# Altium schematic sheet connectors.SchDoc: Oncilla motor control board
size A4; DocumentNumber: 5; Revision: 3; SheetNumber: 5; SheetTotal: 5
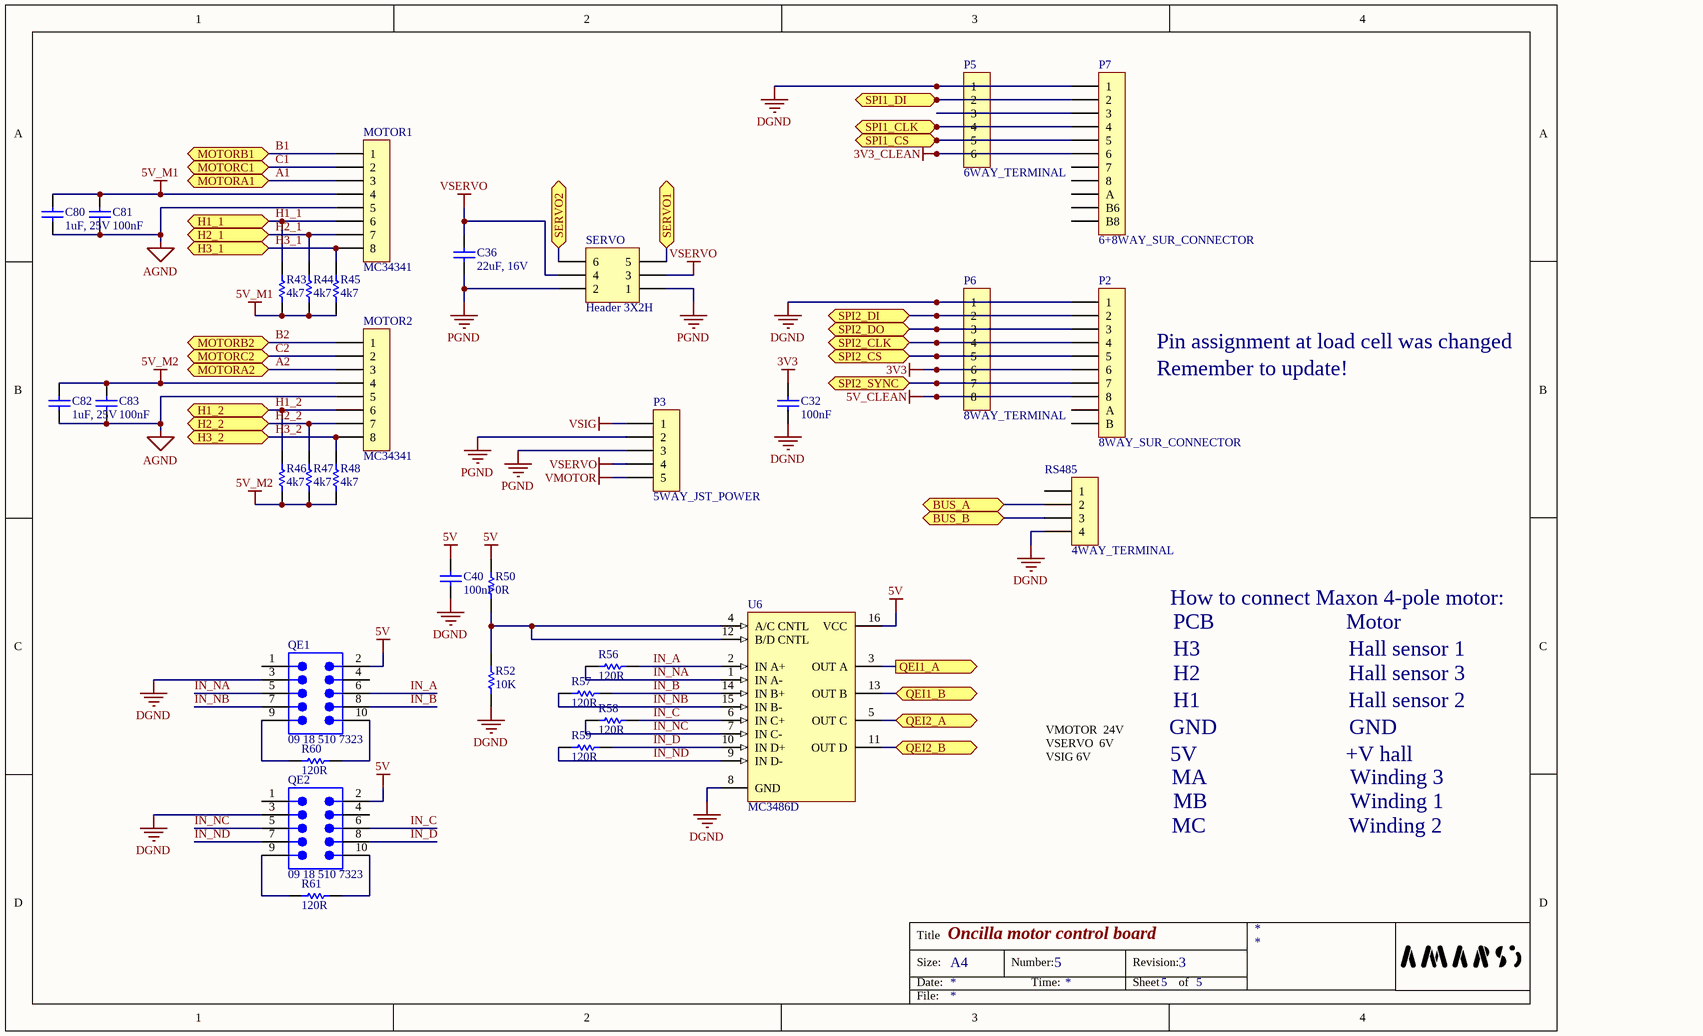
[diagram p0: connectors.SchDoc]

## Parts
C32  100nF  [CAPC1608L]
C36  22uF, 16V  [CAPC3216L]
C40  100nF  [CAPC1608L]
C80  1uF, 25V  [CAPC1608L]
C81  100nF  [CAPC1608L]
C82  1uF, 25V  [CAPC1608L]
C83  100nF  [CAPC1608L]
MOTOR1  MC34341  [MC34341]
MOTOR2  MC34341  [MC34341]
P2  8WAY_SUR_CONNECTOR  [CONNECTOR_8WAY_0.8mm]
P3  5WAY_JST_POWER  [TERMINAL_5WAY_35]
P5  6WAY_TERMINAL  [CONNECTOR_6WAY_RA_1.5MM]
P6  8WAY_TERMINAL  [CONNECTOR_8WAY_RA_1.5MM]
P7  6+8WAY_SUR_CONNECTOR  [CONNECTOR_6+8WAY_0.8mm]
QE1  09 18 510 7323  [918510x323]
QE2  09 18 510 7323  [918510x323]
R43  value 4k7  [RESC1608L]  (hidden comment: 4.7k)
R44  value 4k7  [RESC1608L]  (hidden comment: 4.7k)
R45  value 4k7  [RESC1608L]  (hidden comment: 4.7k)
R46  value 4k7  [RESC1608L]  (hidden comment: 4.7k)
R47  value 4k7  [RESC1608L]  (hidden comment: 4.7k)
R48  value 4k7  [RESC1608L]  (hidden comment: 4.7k)
R50  0R  [RESC1608L]
R52  10k  [RESC1608L]
R56  120R  [RESC1608L]
R57  120R  [RESC1608L]
R58  120R  [RESC1608L]
R59  120R  [RESC1608L]
R60  120R  [RESC1608L]
R61  120R  [RESC1608L]
RS485  4WAY_TERMINAL  [MICROMATCH_4WAY_SE]
SERVO  Header 3X2H  [HDR2X3H]
U6  MC3486D  [751B-03_N]

## Ports
BUS_A, BUS_B, H1_1, H1_2, H2_1, H2_2, H3_1, H3_2, MOTORA1, MOTORA2, MOTORB1, MOTORB2, MOTORC1, MOTORC2, QEI1_A (out), QEI1_B, QEI2_A, QEI2_B, SERVO1 (bidir), SERVO2 (bidir), SPI1_CLK, SPI1_CS, SPI1_DI, SPI2_CLK, SPI2_CS, SPI2_DI, SPI2_DO, SPI2_SYNC

## Nets
3V3: C32.2 P2.6 P6.6
3V3_CLEAN: P5.6 P7.6
5V: C40.2 QE1.2 QE2.2 R50.2 U6.16(VCC)
5V_CLEAN: P2.8 P6.8
5V_M1: C80.2 C81.2 MOTOR1.4 R43.1 R44.1 R45.1
5V_M2: C82.2 C83.2 MOTOR2.4 R46.1 R47.1 R48.1
AGND: C80.1 C81.1 C82.1 C83.1 MOTOR1.5 MOTOR2.5
DGND: C32.1 C40.1 P2.1 P5.1 P6.1 P7.1 QE1.3 QE2.3 R52.1 RS485.4 U6.8(GND)
PGND: C36.1 P3.2 P3.3 SERVO.1 SERVO.2
VMOTOR: P3.5
VSERVO: C36.2 P3.4 SERVO.3 SERVO.4
VSIG: P3.1
A1: MOTOR1.3 ; port MOTORA1
A2: MOTOR2.3 ; port MOTORA2
B1: MOTOR1.1 ; port MOTORB1
B2: MOTOR2.1 ; port MOTORB2
BUS_A: RS485.2 ; port BUS_A
BUS_B: RS485.3 ; port BUS_B
C1: MOTOR1.2 ; port MOTORC1
C2: MOTOR2.2 ; port MOTORC2
H1_1: MOTOR1.6 R43.2 ; port H1_1
H1_2: MOTOR2.6 R46.2 ; port H1_2
H2_1: MOTOR1.7 R44.2 ; port H2_1
H2_2: MOTOR2.7 R47.2 ; port H2_2
H3_1: MOTOR1.8 R45.2 ; port H3_1
H3_2: MOTOR2.8 R48.2 ; port H3_2
IN_A: QE1.6 R56.1 U6.2(IN_A+)
IN_B: QE1.8 R57.1 U6.14(IN_B+)
IN_C: QE2.6 R58.1 U6.6(IN_C+)
IN_D: QE2.8 R59.1 U6.10(IN_D+)
IN_NA: QE1.5 R56.2 U6.1(IN_A-)
IN_NB: QE1.7 R57.2 U6.15(IN_B-)
IN_NC: QE2.5 R58.2 U6.7(IN_C-)
IN_ND: QE2.7 R59.2 U6.9(IN_D-)
QEI1_A: U6.3(OUT_A) ; port QEI1_A
QEI1_B: U6.13(OUT_B) ; port QEI1_B
QEI2_A: U6.5(OUT_C) ; port QEI2_A
QEI2_B: U6.11(OUT_D) ; port QEI2_B
SERVO1: SERVO.5 ; port SERVO1
SERVO2: SERVO.6 ; port SERVO2
SPI1_CLK: P5.4 P7.4 ; port SPI1_CLK
SPI1_CS: P5.5 P7.5 ; port SPI1_CS
SPI1_DI: P5.2 P7.2 ; port SPI1_DI
SPI2_CLK: P2.4 P6.4 ; port SPI2_CLK
SPI2_CS: P2.5 P6.5 ; port SPI2_CS
SPI2_DI: P2.2 P6.2 ; port SPI2_DI
SPI2_DO: P2.3 P6.3 ; port SPI2_DO
SPI2_SYNC: P2.7 P6.7 ; port SPI2_SYNC
NetP5_3: P5.3 P7.3
NetQE1_9: QE1.9 R60.2
NetQE1_10: QE1.10 R60.1
NetQE2_9: QE2.9 R61.2
NetQE2_10: QE2.10 R61.1
NetR50_1: R50.1 R52.2 U6.4(A/C_CNTL) U6.12(B/D_CNTL)

Not connected (* = marked no-connect by the designer): P2 A B; P7 7 8 A B6 B8; QE1 1 4; QE2 1 4; RS485 1

## Notes on the sheet
- Pin assignment at load cell was changed
- Remember to update!
- How to connect Maxon 4-pole motor:
- PCB                        Motor
- H3                           Hall sensor 1
- H2                           Hall sensor 3
- H1                           Hall sensor 2
- VMOTOR  24V
  VSERVO  6V
  VSIG 6V
- GND                        GND
- 5V                           +V hall
- MA                          Winding 3
- MC                          Winding 2
- MB                          Winding 1
- Title
- Size:
- Date:
- A4
- Number:
- Time:
- Revision:
- Sheet
- of
- File:

## Library data of the parts
C32 C36 C40 C80-C83 = Cap Semi: Capacitor (Semiconductor SIM Model); Published: 8-Jun-2000; LatestRevisionDate: 29-May-2009; LatestRevisionNote: IPC-7351 Footprint Added.; PackageReference: C1206; Publisher: Altium Limited; PackageDescription: Chip Capacitor
  C32 C40 C81 C83: Value: 100nF
  C36: Value: 22uF, 16V
  C80 C82: Value: 1uF
MOTOR1 MOTOR2 = MC34341: MC34341 - STECKER,90°,8KONT
QE1 QE2 = 09 18 510 7323: Flat Cable Connector (IDC), Low-Profile Male Header, Angled Solder Pin, 10 Contacts, Performance Level 3; PCB_Layout: Complies with manufacturer's recommendation.; DrillSize: Corresponds to nominal value.; Published: 15-Nov-2004; DatasheetDocument: Sep-2003; PackageDocument: 03-Jun-2003; PackageReference: 918510x323; Publisher: Altium Limited; ComponentLink1Description: Manufacturer Link; ComponentLink1URL: http://www.harting.com/; ComponentLink2Description: Selection Guide; ComponentLink2URL: http://www.harting.com/imperia/md/content/steckverbinderundsystemkomponenten/folder/interface_engl_chapter_09.pdf
R43-R48 R50 R52 R56-R61 = Res Semi: Semiconductor Resistor; Published: 8-Jun-2000; LatestRevisionDate: 17-Jul-2002; LatestRevisionNote: Re-released for DXP Platform.; PackageReference: AXIAL-0.5; Publisher: Altium Limited
  R50: Value: 0R
  R52: Value: 10K
  R56-R61: Value: 120R
SERVO = Header 3X2H: Header, 3-Pin, Dual row, Right Angle; LatestRevisionDate: 17-Jul-2002; LatestRevisionNote: Re-released for DXP Platform.; Publisher: Altium Limited
U6 = MC3486D: Quad EIA-422/423 Line Receiver; Published: 17-Jul-2002; LatestRevisionDate: 13-Apr-2006; LatestRevisionNote: IPC-7351 Footprint Added.; DatasheetVersion: 1988; PackageVersion: 1991; PackageReference: 751B-03; Publisher: Altium Limited; PackageDescription: 16-Pin Small Outline Integrated Circuit 1.27 mm Pitch; Code_JEDEC: MS-012-AC; Code_IPC: SOIC127P600-16; ComponentLink1Description: Manufacturer Link; ComponentLink1URL: http://www.onsemi.com/site/products/parametrics/0,4446,178,00.html